# EAGLE design serialdb9 (EAGLE 7.2.0)
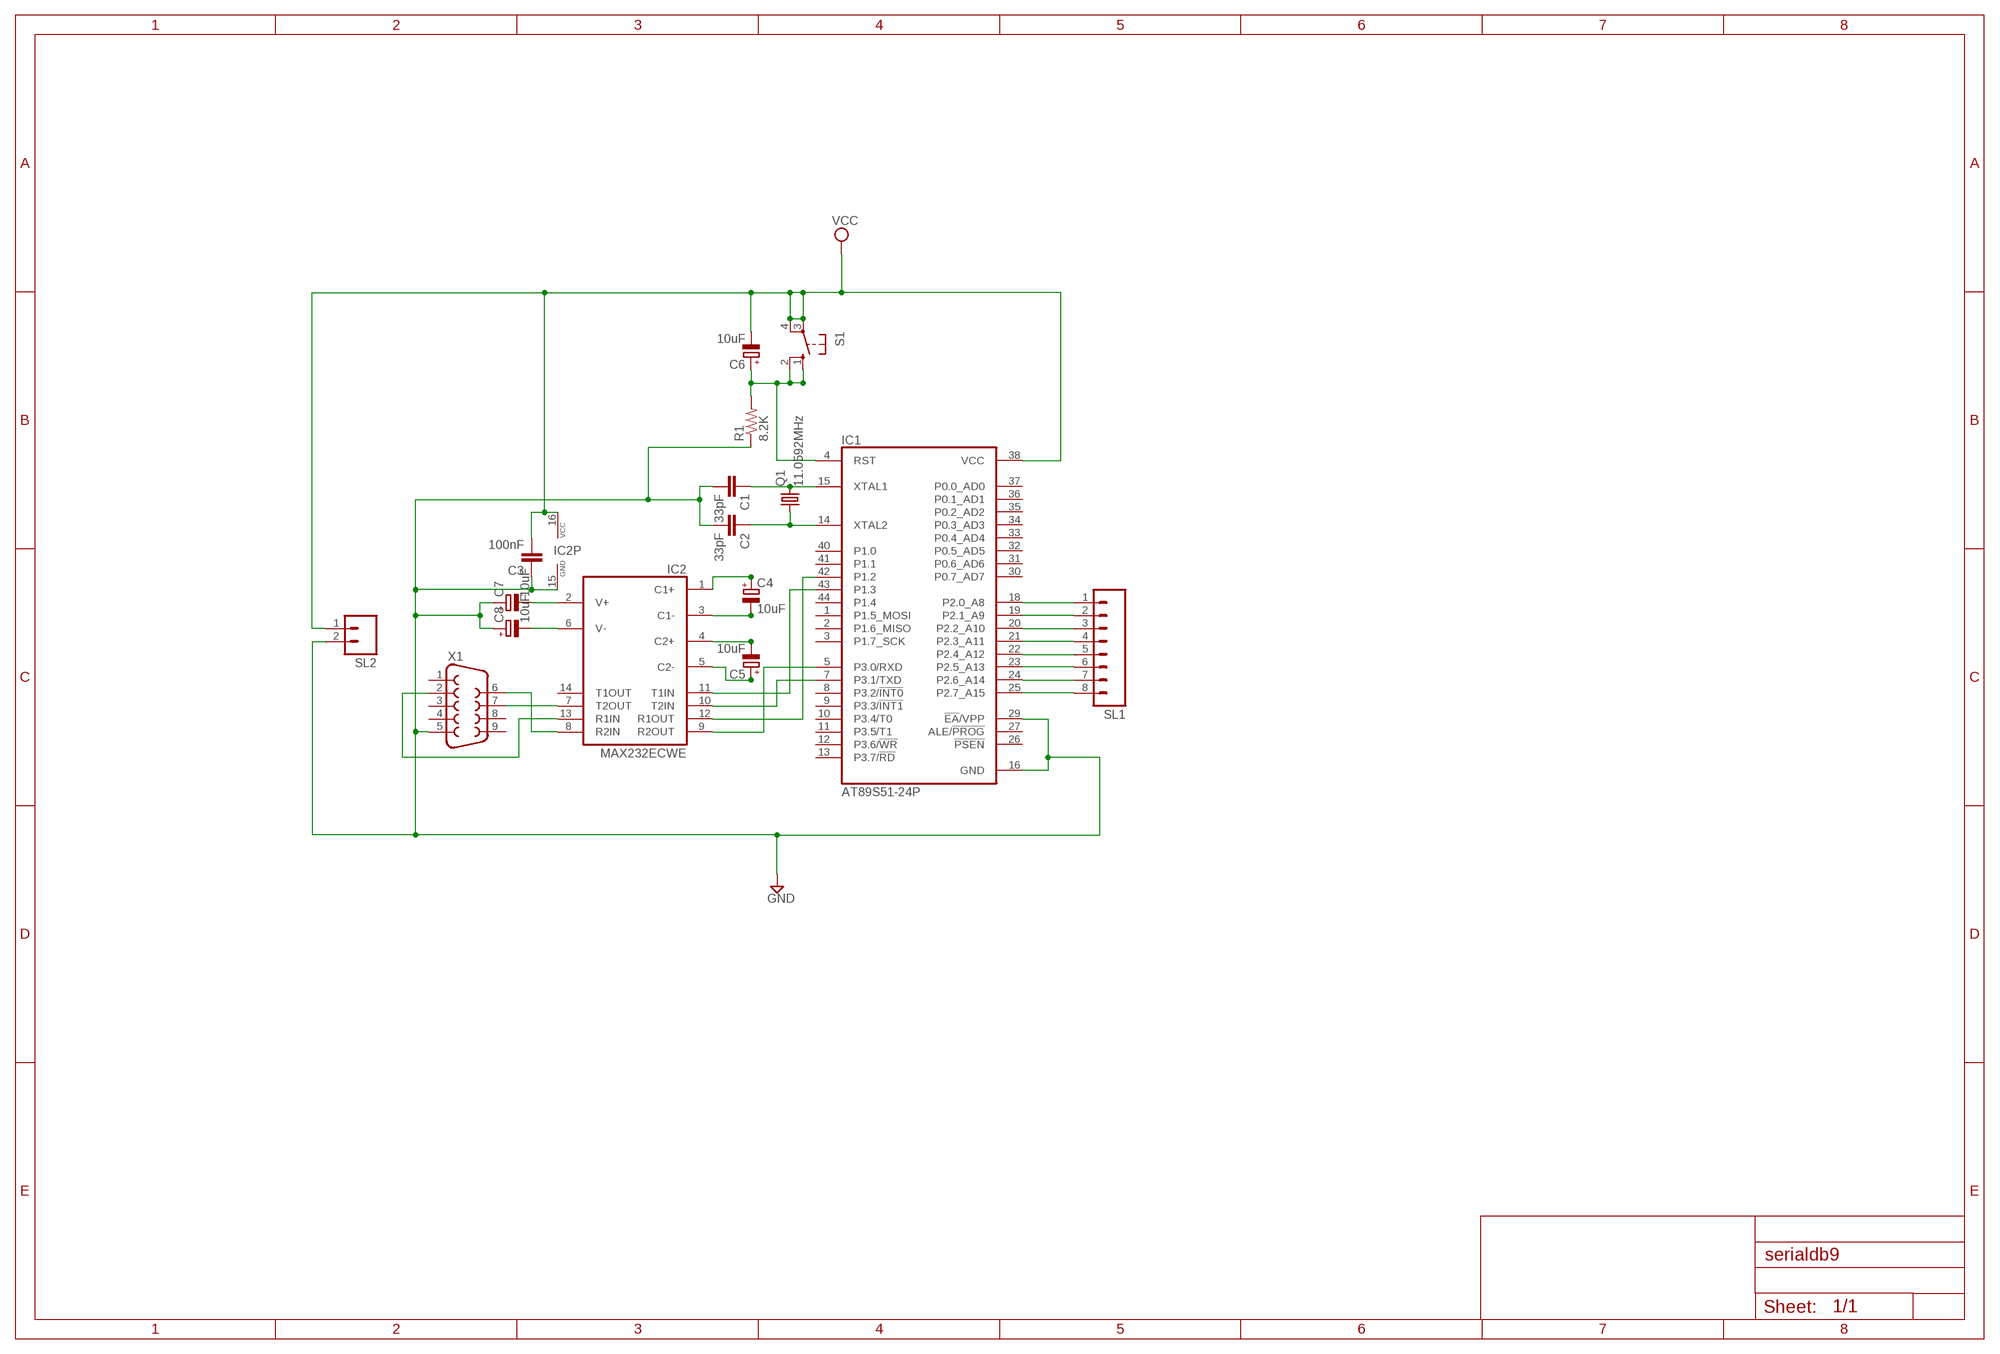
[diagram p0: schematic, sheet 1]

## Parts
C1  33pF  C-EUC1206K  [C1206K]
C2  33pF  C-EUC1206K  [C1206K]
C3  100nF  C-EUC1206K  [C1206K]
C4  10uF  CPOL-EU140CLH-1010  [140CLH-1010]
C5  10uF  CPOL-EU140CLH-1010  [140CLH-1010]
C6  10uF  CPOL-EU140CLH-1010  [140CLH-1010]
C7  10uF  CPOL-EU140CLH-1010  [140CLH-1010]
C8  10uF  CPOL-EU140CLH-1010  [140CLH-1010]
IC1  AT89S51-24P  [TQFP44]
IC2  MAX232ECWE  [SO16L]
Q1  11.0592MHz  CRYSTALTC26V  [TC26V]
R1  8.2K  R-US_M1206  [M1206]
S1  10-XX  [B3F-10XX]
SL1  MA08  [08PA]
SL2  MA02  [02PA]
X1  F09V  [F09V]

## Nets
GND: C1.2 C2.2 C3.1 C7.+ C8.+ IC1.16(GND) IC1.29(!EA!/VPP) IC2.15(GND) R1.1 SL2.2 X1.5
N$1: C4.- IC2.3(C1-)
N$2: C4.+ IC2.1(C1+)
N$3: C5.- IC2.4(C2+)
N$4: C5.+ IC2.5(C2-)
N$5: IC1.43(P1.3) IC2.11(T1IN)
N$6: IC1.42(P1.2) IC2.12(R1OUT)
N$7: IC1.7(P3.1/TXD) IC2.10(T2IN)
N$8: IC1.5(P3.0/RXD) IC2.9(R2OUT)
N$10: C6.+ IC1.4(RST) R1.2 S1.1(S) S1.2(S1)
N$11: C1.1 IC1.15(XTAL1) Q1.2
N$12: C2.1 IC1.14(XTAL2) Q1.1
N$14: IC1.25(P2.7_A15) SL1.8
N$15: IC1.24(P2.6_A14) SL1.7
N$16: IC1.23(P2.5_A13) SL1.6
N$17: IC1.22(P2.4_A12) SL1.5
N$18: IC1.21(P2.3_A11) SL1.4
N$19: IC1.20(P2.2_A10) SL1.3
N$20: IC1.19(P2.1_A9) SL1.2
N$21: IC1.18(P2.0_A8) SL1.1
N$22: IC2.7(T2OUT) X1.7
N$23: IC2.13(R1IN) X1.2
N$24: IC2.8(R2IN) X1.6
N$26: C7.- IC2.2(V+)
N$27: C8.- IC2.6(V-)
VCC: C3.2 C6.- IC1.38(VCC) IC2.16(VCC) S1.3(P) S1.4(P1) SL2.1
Unconnected: IC1.1(P1.5_MOSI) IC1.2(P1.6_MISO) IC1.3(P1.7_SCK) IC1.8(P3.2/!INT0) IC1.9(P3.3/!INT1) IC1.10(P3.4/T0) IC1.11(P3.5/T1) IC1.12(P3.6/!WR) IC1.13(P3.7/!RD) IC1.26(!PSEN) IC1.27(ALE/!PROG) IC1.30(P0.7_AD7) IC1.31(P0.6_AD6) IC1.32(P0.5_AD5) IC1.33(P0.4_AD4) IC1.34(P0.3_AD3) IC1.35(P0.2_AD2) IC1.36(P0.1_AD1) IC1.37(P0.0_AD0) IC1.40(P1.0) IC1.41(P1.1) IC1.44(P1.4) IC2.14(T1OUT) X1.1 X1.3 X1.4 X1.8 X1.9

## Power pins joined to a net without a drawn wire
GND: IC1.17(GND)

## Library data of the parts
C1-C3 = resistor:C-EU: CAPACITOR, European symbol
C4-C8 = resistor:CPOL-EU: POLARIZED CAPACITOR, European symbol
IC1 = atmel:AT89S51*P: 8-bit Microcontroller with 4K BytesIn-System Programmable Flash Source: http://www.atmel.com/dyn/resources/prod_documents/doc2487.pdf; OC_FARNELL: unknown; OC_NEWARK: unknown
IC2 = maxim:MAX232ECWE: RS232 TRANSCEIVER; MF: MAXIM; MPN: MAX232ECWE+; OC_FARNELL: 9724435; OC_NEWARK: 67K4440
Q1 = crystal:CRYSTAL: CRYSTAL; OC_FARNELL: unknown; OC_NEWARK: unknown
R1 = resistor:R-US_: RESISTOR, American symbol
S1 = switch-omron:10-XX: OMRON SWITCH; MPN: B3F-1000; OC_FARNELL: 176432; OC_NEWARK: 36M3542
SL1 = con-amp-quick:MA08: AMP QUICK CONNECTOR; OC_FARNELL: unknown; OC_NEWARK: unknown
SL2 = con-amp-quick:MA02: AMP QUICK CONNECTOR; OC_FARNELL: unknown; OC_NEWARK: unknown
X1 = con-subd:F09: SUB-D; OC_FARNELL: unknown; OC_NEWARK: unknown

## Board
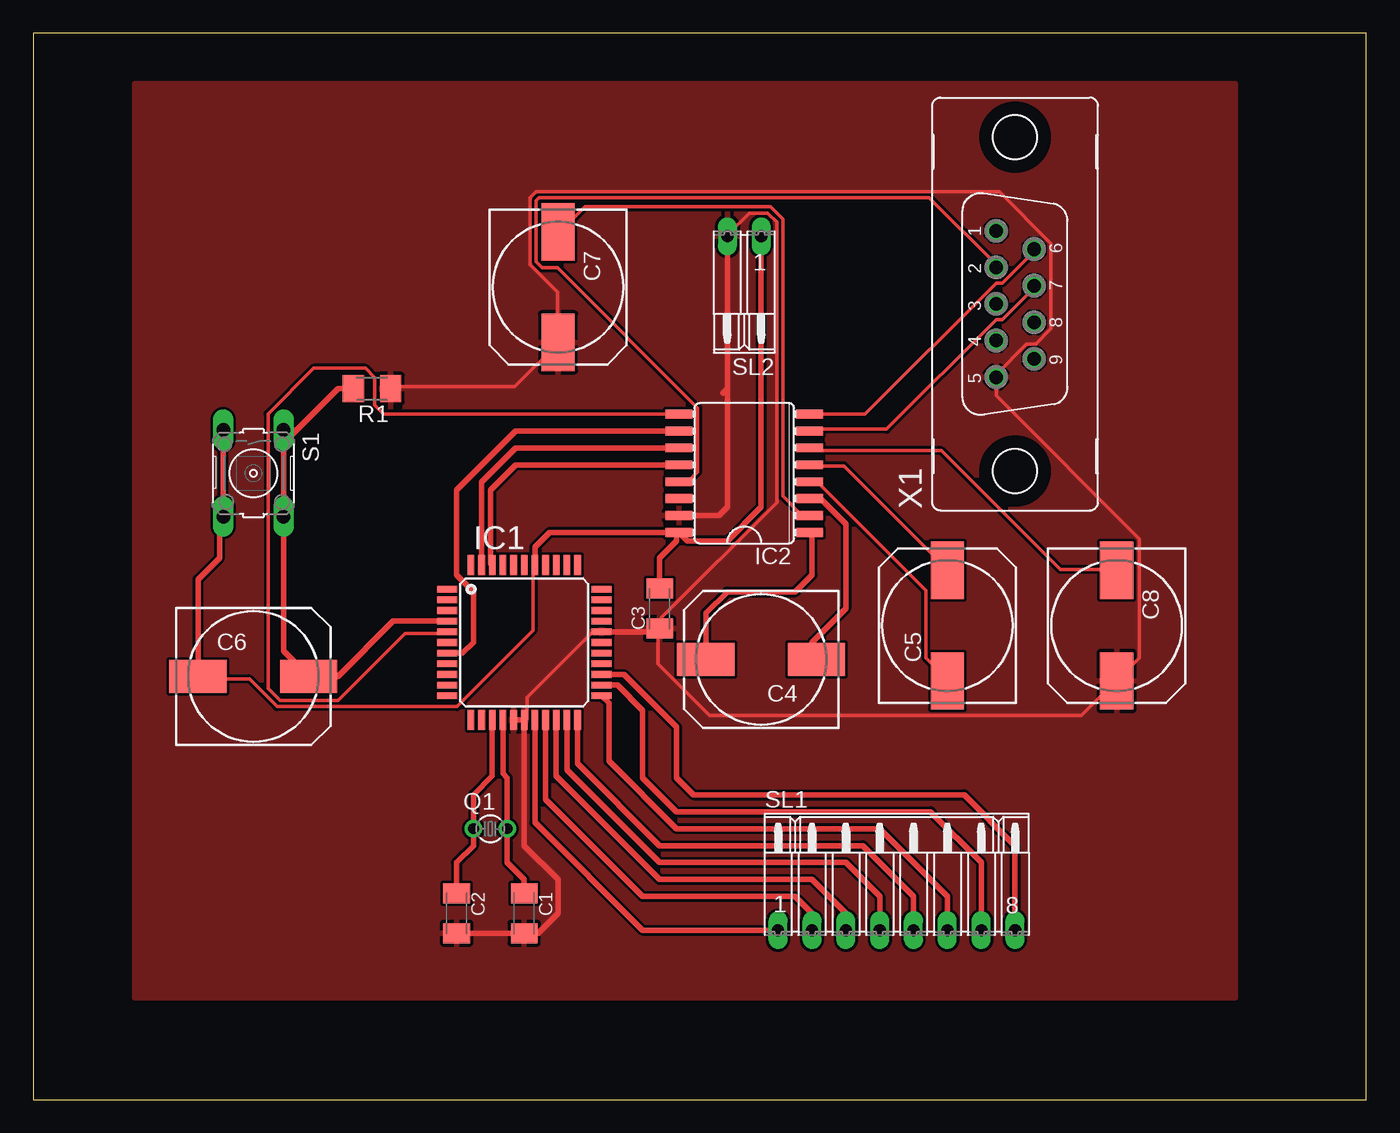
[diagram p1: board, top side]

Size 100 x 80 mm. Coordinates in mm from the lower left corner, seen from the top.
Outline: 0,0 100,0 100,80 0,80 0,0
Copper layers (1*16): Top 0.035mm / dielectric 1.5mm / Bottom 0.035mm
Design rules "default": minimum track width 10mil, minimum drill 24mil, track to track 8mil, track to pad 8mil, pad to pad 8mil, via to via 8mil, smd to smd 8mil, copper to edge 40mil, drill to drill 8mil, minimum pad ring 10mil, minimum via ring 8mil, stop-mask expansion 4mil, vias tented up to drill 0mil, thermal gap 10mil

### Footprints (pad centres in the part's own frame; a part is rotated, then mirrored left to right if it is on the bottom)
C1206K = smd 1.5 x 2: 1 -1.5,0; 2 1.5,0
140CLH-1010 = smd 4.3 x 2.5: + 4.15,0; - -4.15,0
TQFP44 = smd 1.5 x 0.5: 1 -5.8,4; 2 -5.8,3.2; 3 -5.8,2.4; 4 -5.8,1.6; 5 -5.8,0.8; 6 -5.8,0; 7 -5.8,-0.8; 8 -5.8,-1.6; 9 -5.8,-2.4; 10 -5.8,-3.2; 11 -5.8,-4; 23 5.8,-4; 24 5.8,-3.2; 25 5.8,-2.4; 26 5.8,-1.6; 27 5.8,-0.8; 28 5.8,0; 29 5.8,0.8; 30 5.8,1.6; 31 5.8,2.4; 32 5.8,3.2; 33 5.8,4 | smd 0.5 x 1.5: 12 -4,-5.8; 13 -3.2,-5.8; 14 -2.4,-5.8; 15 -1.6,-5.8; 16 -0.8,-5.8; 17 0,-5.8; 18 0.8,-5.8; 19 1.6,-5.8; 20 2.4,-5.8; 21 3.2,-5.8; 22 4,-5.8; 34 4,5.8; 35 3.2,5.8; 36 2.4,5.8; 37 1.6,5.8; 38 0.8,5.8; 39 0,5.8; 40 -0.8,5.8; 41 -1.6,5.8; 42 -2.4,5.8; 43 -3.2,5.8; 44 -4,5.8
SO16L = smd 0.66 x 2.032: 1 -4.445,-4.902; 2 -3.175,-4.902; 3 -1.905,-4.902; 4 -0.635,-4.902; 5 0.635,-4.902; 6 1.905,-4.902; 7 3.175,-4.902; 8 4.445,-4.902; 9 4.445,4.902; 10 3.175,4.902; 11 1.905,4.902; 12 0.635,4.902; 13 -0.635,4.902; 14 -1.905,4.902; 15 -3.175,4.902; 16 -4.445,4.902
TC26V = drill 0.813: 1 -1.27,0; 2 1.27,0
M1206 = smd 1.6 x 2: 1 -1.4,0; 2 1.4,0
B3F-10XX = drill 1.016 long: 1 -3.251,2.261; 2 3.251,2.261; 3 -3.251,-2.261; 4 3.251,-2.261
08PA = drill 0.914 long: 1 -8.89,0; 2 -6.35,0; 3 -3.81,0; 4 -1.27,0; 5 1.27,0; 6 3.81,0; 7 6.35,0; 8 8.89,0
02PA = drill 0.914 long: 1 -1.27,0; 2 1.27,0
F09V = drill 1.016 octagon: 1 5.486,1.422; 2 2.743,1.422; 3 0,1.422; 4 -2.743,1.422; 5 -5.486,1.422; 6 4.115,-1.422; 7 1.372,-1.422; 8 -1.372,-1.422; 9 -4.115,-1.422 | hole 3.302: -12.522,0; 12.522,0

### Placement (x,y rotation side)
C1  36.83,13.97 270 top
C2  31.75,13.97 270 top
C3  46.99,36.83 90 top
C4  54.61,33.02 180 top
C5  68.58,35.56 90 top
C6  16.51,31.75 0 top
C7  39.37,60.96 270 top
C8  81.28,35.56 270 top
IC1  36.83,34.29 0 top
IC2  53.34,46.99 90 top
Q1  34.29,20.32 0 top
R1  25.4,53.34 180 top
S1  16.51,46.99 270 top
SL1  64.77,12.7 0 top
SL2  53.34,64.77 180 top
X1  73.66,59.69 90 top

### Tracks (layer width: path | path; a pad name or v marks a point on that pad's centre or on a via)
GND
  Top 0.254: 36.83,27.94 36.8,28.12 36.8,28.35 IC1.17 37.03,28.57 37.03,30.18 41.83,34.98 42.52,34.98 IC1.29 | SL2.2 52.12,64.92 53.72,66.52 55.09,66.52 55.78,65.84 55.78,44.81 47.09,36.12 47.09,35.66 C3.1 46.86,34.98 46.86,32.69 50.75,28.8 78.64,28.8 81.15,31.32 C8.+ 81.38,31.55 82.98,33.15 82.98,42.06 72.24,52.81 X1.5 72.24,54.41 74.52,56.69 75.21,56.69 76.35,57.84 76.35,64.24 72.47,68.12 37.72,68.12 37.26,67.67 37.26,62.64 39.32,60.58 39.32,56.92 C7.+ 39.32,56.69 36.12,53.49 26.98,53.49 R1.1
  Top 0.406: IC2.15 51.44,43.81 52.07,44.45 52.07,53.34 | 52.07,53.34 SL2.2 | C2.2 C1.2 37.87,12.47 39.37,13.97 39.37,16.51 36.83,19.05 36.83,27.94 | IC1.16 IC1.17 | IC1.29 46.75,35.09 C3.1 46.99,35.56 | 51.73,53 52.07,53.34
  pour Top: 7.62,76.2 7.62,7.62 90.17,7.62 90.17,76.2
N$1
  Top 0.406: IC2.3 59.05,45.09 60.96,43.18 60.96,36.83 58.42,34.29 58.42,33.36 C4.-
N$2
  Top 0.406: C4.+ 50.46,36.49 52.07,38.1 57.15,38.1 58.42,39.37 58.42,42.37 IC2.1
N$3
  Top 0.254: IC2.4 58.29,46.18 58.98,46.18 66.98,38.18 66.98,33.15 68.58,31.55 C5.-
N$4
  Top 0.254: IC2.5 58.29,47.55 60.81,47.55 68.58,39.78 C5.+
N$5
  Top 0.406: IC1.43 33.63,46.33 36.2,48.9 IC2.11
N$6
  Top 0.406: IC2.12 36.2,47.62 34.29,45.72 34.29,40.23 IC1.42
N$7
  Top 0.406: IC2.10 36.2,50.16 31.75,45.72 31.75,39.37 33.02,38.1 33.02,34.29 32.22,33.49 IC1.7
N$8
  Top 0.254: IC2.9 26.29,51.44 25.6,52.12 25.6,54.18 24.92,54.86 21.03,54.86 17.6,51.44 17.6,30.86 18.52,29.95 22.86,29.95 27.89,34.98 30.86,34.98 IC1.5
N$9
  pour Top: 7.62,76.2 10.16,76.2 11.43,76.2
N$10
  Top 0.254: R1.2 24,53.26 R1.2
  Top 0.406: IC1.4 27,35.89 22.86,31.75 C6.+ 18.77,33.64 S1.2 18.77,49.25 19.76,50.24 | 24.13,53.34 R1.2 22.86,53.34 19.76,50.24 | S1.1 19.76,50.24
N$11
  Top 0.254: C1.1 36.8,15.54 36.83,15.54
  Top 0.406: IC1.15 35.23,24.46 35.56,24.13 Q1.2 35.56,17.78 36.83,16.51 36.83,15.54 C1.1 36.83,15.24
N$12
  Top 0.406: IC1.14 34.43,24.27 33.02,22.86 Q1.1 33.02,19.05 31.75,17.78 C2.1
N$14
  Top 0.406: IC1.25 44.31,31.89 48.26,27.94 48.26,24.13 49.53,22.86 69.85,22.86 73.66,19.05 SL1.8
N$15
  Top 0.254: SL1.7 71.09,12.8 71.09,13.95 71.12,13.97
  Top 0.406: IC1.24 43.84,31.09 45.72,29.21 45.72,24.13 48.26,21.59 67.31,21.59 71.12,17.78 71.12,13.97
N$16
  Top 0.406: SL1.6 68.58,15.24 63.5,20.32 48.26,20.32 43.18,25.4 43.18,29.74 IC1.23
N$17
  Top 0.406: IC1.22 40.83,25.21 46.99,19.05 62.23,19.05 66.04,15.24 SL1.5
N$18
  Top 0.406: IC1.21 40.03,24.74 46.99,17.78 60.96,17.78 63.5,15.24 SL1.4
N$19
  Top 0.406: IC1.20 39.23,24.27 46.99,16.51 58.42,16.51 60.96,13.97 SL1.3
N$20
  Top 0.406: IC1.19 38.43,22.53 45.72,15.24 57.15,15.24 58.42,13.97 SL1.2
N$21
  Top 0.406: IC1.18 37.63,20.79 45.72,12.7 SL1.1
N$22
  Top 0.254: IC2.7 58.29,50.29 64.01,50.29 72.24,58.52 72.69,58.52 75.21,61.04 X1.7
N$23
  Top 0.254: IC2.13 48.46,46.41 49.15,46.41 49.84,47.09 49.84,51.89 39.32,62.41 38.18,62.41 37.72,62.87 37.72,67.44 37.95,67.67 67.21,67.67 72.24,62.64 X1.2
N$24
  Top 0.254: IC2.8 62.41,51.44 72.24,61.27 72.69,61.27 75.21,63.78 X1.6
N$26
  Top 0.254: IC2.2 58.06,43.89 57.61,43.89 56.24,45.26 56.24,66.06 55.32,66.98 41.38,66.98 39.55,65.15 C7.-
N$27
  Top 0.254: IC2.6 58.29,48.69 68.12,48.69 77.04,39.78 81.15,39.78 C8.-
VCC
  Top 0.254: C6.- 12.57,31.55 16.23,31.55 18.29,29.49 31.77,29.49 37.49,35.2 37.49,40.01 IC1.38
  Top 0.406: IC2.16 48.26,42.37 48.26,41.91 46.99,40.64 C3.2 | IC2.16 38.73,42.55 37.63,41.44 IC1.38 | SL2.1 54.61,44.45 52.07,41.91 49.07,41.91 IC2.16 | C6.- 12.36,39.03 13.97,40.64 13.97,43.46 S1.4 S1.3